# EAGLE design chassis (EAGLE 7.3.0)
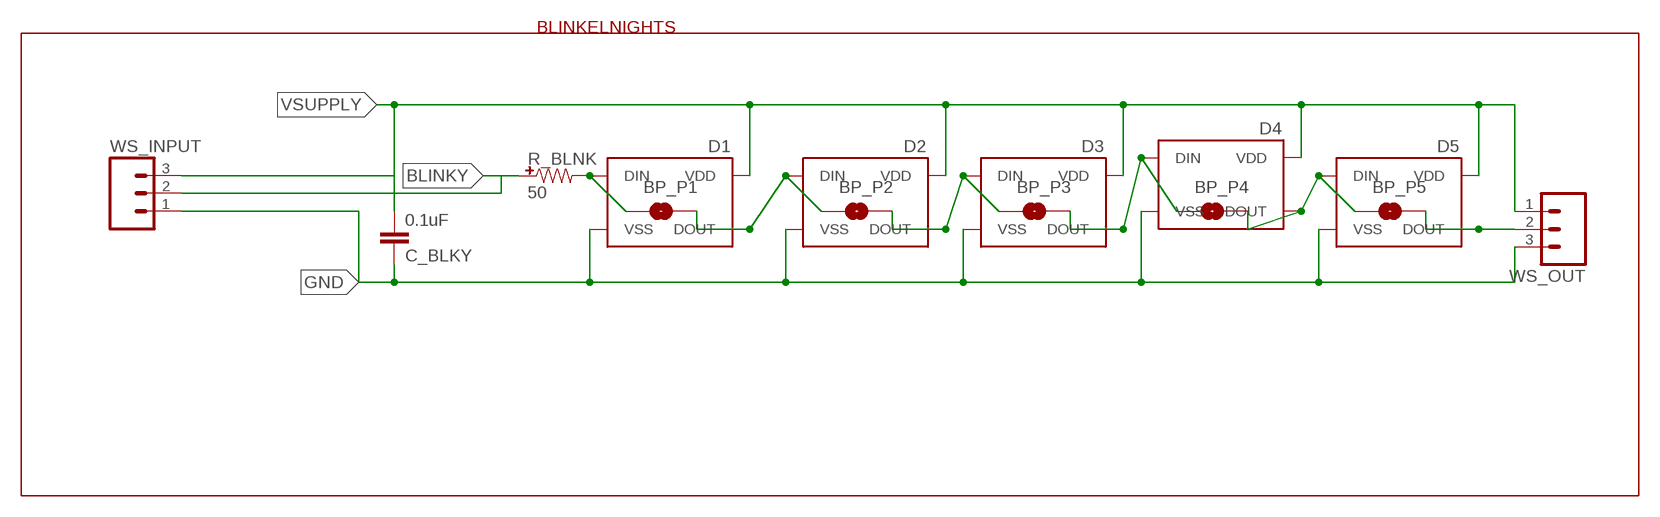
[diagram p0: schematic, sheet 1]

## Parts
BP_P1  JUMPER-PAD-2-NOYES_SILK  [PAD-JUMPER-2-NO_YES_SILK]
BP_P2  JUMPER-PAD-2-NOYES_SILK  [PAD-JUMPER-2-NO_YES_SILK]
BP_P3  JUMPER-PAD-2-NOYES_SILK  [PAD-JUMPER-2-NO_YES_SILK]
BP_P4  JUMPER-PAD-2-NOYES_SILK  [PAD-JUMPER-2-NO_YES_SILK]
BP_P5  JUMPER-PAD-2-NOYES_SILK  [PAD-JUMPER-2-NO_YES_SILK]
C_BLKY  0.1uF  CAPUNIVERSAL  [0402-0603-0805-UNIVERSAL]
D1  WS2812B  [WS2812B]
D2  WS2812B  [WS2812B]
D3  WS2812B  [WS2812B]
D4  WS2812B  [WS2812B]
D5  WS2812B  [WS2812B]
R_BLNK  50  RESISTORUNIVERSAL  [0402-0603-0805-UNIVERSAL]
WS_INPUT  M03LOCK  [1X03_LOCK]
WS_OUT  M03LOCK  [1X03_LOCK]

## Nets
BLINKY: R_BLNK.- WS_INPUT.2
GND: C_BLKY.- D1.3(VSS) D2.3(VSS) D3.3(VSS) D4.3(VSS) D5.3(VSS) WS_INPUT.1 WS_OUT.3
N$3: BP_P1.2 BP_P2.1 D1.2(DOUT) D2.4(DIN)
N$4: BP_P4.2 BP_P5.1 D4.2(DOUT) D5.4(DIN)
N$6: BP_P5.2 D5.2(DOUT) WS_OUT.2
N$10: BP_P1.1 D1.4(DIN) R_BLNK.+
N$11: BP_P2.2 BP_P3.1 D2.2(DOUT) D3.4(DIN)
N$12: BP_P3.2 BP_P4.1 D3.2(DOUT) D4.4(DIN)
VSUPPLY: C_BLKY.+ D1.1(VDD) D2.1(VDD) D3.1(VDD) D4.1(VDD) D5.1(VDD) WS_INPUT.3 WS_OUT.1

## Notes on the sheet
- BLINKELNIGHTS

## Library data of the parts
BP_P1-BP_P5 = SparkFun-Passives:JUMPER-PAD-2-NO
C_BLKY = tekdemo:CAP: Capacitor Standard 0603 ceramic capacitor, and 0.1" leaded capacitor.
D1-D5 = tekdemo:WS2812B: WS2812B - Intelligent control LED integrated light source Technical Specifications: Power Supply Voltage (VDD): 3.5 to 5.3 V Input Voltage (VI): -0.5 to VDD+0.5 V Operating Junction Temperature (Topt): -25°C to +80°C Storage Temperature Range (Tstg): -55°C to +150°C
R_BLNK = tekdemo:RESISTOR: Resistor Basic schematic elements and footprints for 0603, 1206, and PTH resistors.
WS_INPUT WS_OUT = SparkFun-Connectors:M03: Header 3 Standard 3-pin 0.1" header. Use with straight break away headers (SKU : PRT-00116), right angle break away headers (PRT-00553), swiss pins (PRT-00743), machine pins (PRT-00117), and female headers (PRT-00115). Molex polarized connector foot print use with SKU : PRT-08232 with associated crimp pins and housings.

## Board
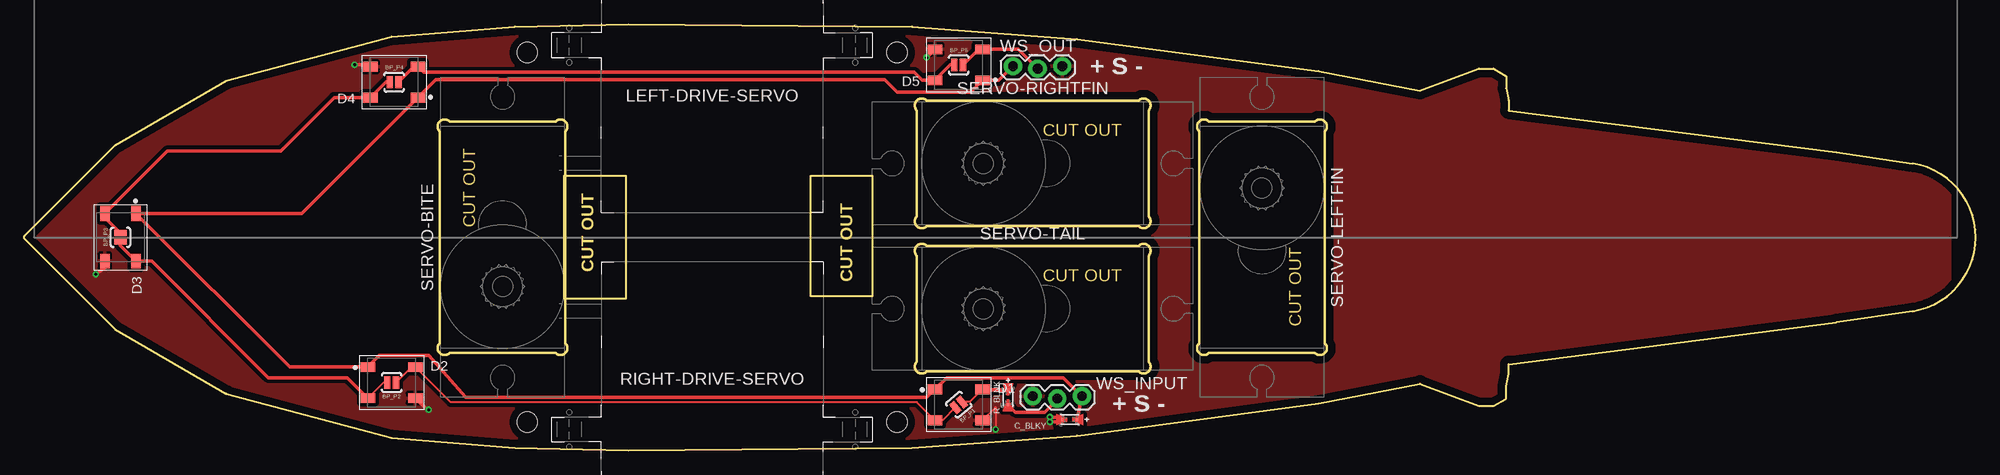
[diagram p1: board, top side]
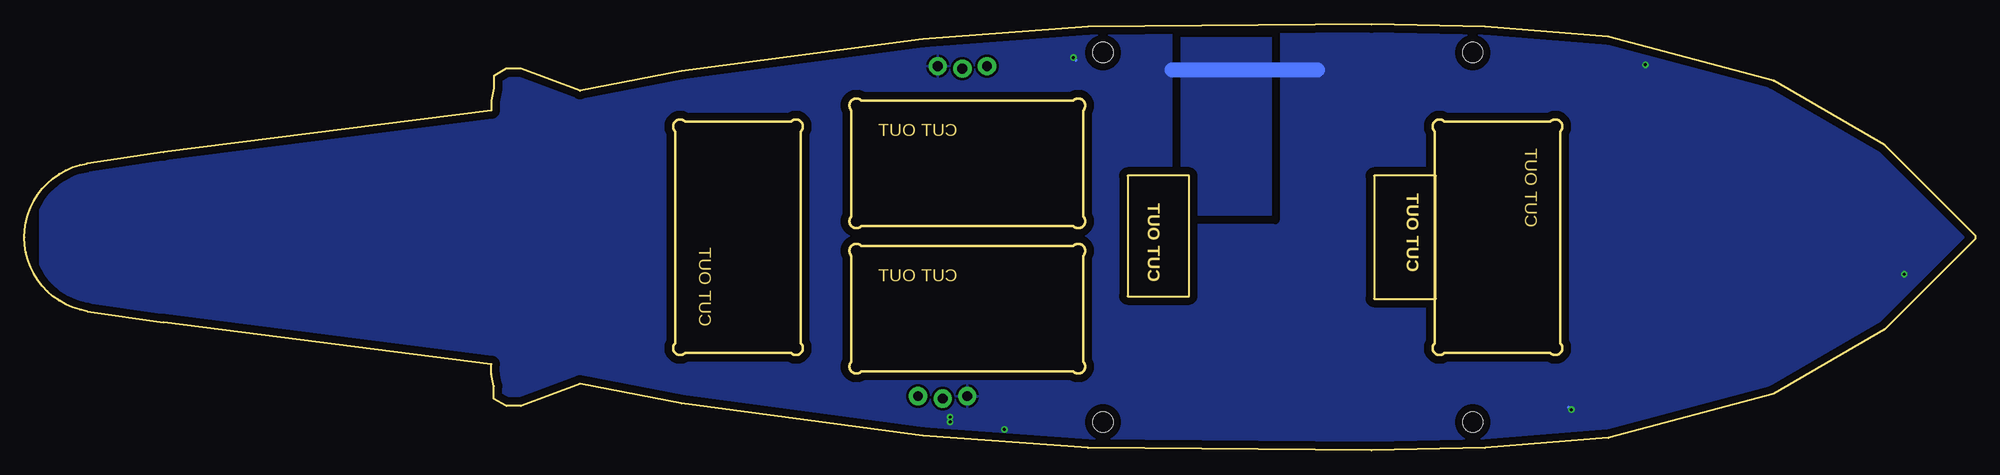
[diagram p2: board, bottom side, seen from below]

Size 201.04 x 43.94 mm. Coordinates in mm from the lower left corner, seen from the top.
Outline: 0,22.1 9.4,31.5 20.83,38.1 37.85,42.67 50.55,43.69 62.23,43.94 91.44,43.69 108.46,42.42 133.35,39.12 143.76,37.08 149.86,39.37 151.38,39.37 152.65,38.61 152.65,37.34 152.91,36.07 152.91,35.05 186.69,30.73 194.56,29.59 arc-161 194.56,14.35 186.69,13.21 152.91,8.89 152.91,7.87 152.65,6.6 152.65,5.33 151.38,4.57 149.86,4.57 143.76,6.86 133.35,4.83 108.46,1.52 91.44,0.25 62.23,0 50.55,0.25 37.85,1.27 20.83,5.84 9.4,12.45 0,21.84 0,22.1
Outline: 55.63,15.62 55.63,28.32 61.98,28.32 61.98,15.62 55.63,15.62
Outline: 81.03,15.88 81.03,28.32 87.38,28.32 87.38,15.88 81.03,15.88
Copper layers (1*16): Top 0.0356mm / dielectric 1.5011mm / Bottom 0.0356mm
Design rules "LaenPCBOrder-tented *": minimum track width 6mil, minimum drill 13mil, track to track 6mil, track to pad 6mil, pad to pad 6mil, via to via 6mil, smd to smd 0mil, copper to edge 30mil, drill to drill 6mil, minimum pad ring 7mil, minimum via ring 7mil, stop-mask expansion 4mil, vias tented up to drill 25mil, thermal gap 10mil
Holes 2.1 mm at 51.82,41.02 89.92,41.02 89.92,2.92 51.82,2.92
bRestrict: 4 lines
Milling: 178 lines

### Footprints (pad centres in the part's own frame; a part is rotated, then mirrored left to right if it is on the bottom)
PAD-JUMPER-2-NO_YES_SILK = smd 0.635 x 1.27: 1 -0.45,0; 2 0.45,0
0402-0603-0805-UNIVERSAL = smd 0.254 x 0.254: + -0.762,0; - 0.762,0
WS2812B = smd 1.5 x 1: 1 -2.45,1.6; 2 -2.45,-1.6; 3 2.45,-1.6; 4 2.45,1.6
1X03_LOCK = drill 1.016 pad 1.88: 1 0,0.127; 2 2.54,-0.127; 3 5.08,0.127

### Placement (x,y rotation side)
BP_P1  96.27,4.7 220 top
BP_P2  37.85,6.98 180 top
BP_P3  9.91,21.97 90 top
BP_P4  38.1,37.97 0 top
BP_P5  96.27,39.75 0 top
C_BLKY  107.7,3.17 180 top
D1  96.27,4.7 0 top
D2  37.85,6.98 0 top
D3  9.91,21.97 270 top
D4  38.1,37.97 180 top
D5  96.27,39.75 180 top
LEFT-DRIVE-SERVO  [MICROSERVO-HORIZONTAL]  59.44,24.51 0 top
R_BLNK  101.35,5.46 270 top
RIGHT-DRIVE-SERVO  RIGHT-DRIVE-SERVO  [MICROSERVO-HORIZONTAL-FLIPPED]  82.3,19.43 180 top
SERVO-BITE  [MICROSERVER-VERTICAL]  55.63,10.54 90 top
SERVO-LEFTFIN  [MICROSERVER-VERTICAL]  121.16,33.4 270 top
SERVO-RIGHTFIN  [MICROSERVER-VERTICAL]  92.46,23.24 0 top
SERVO-TAIL  [MICROSERVER-VERTICAL]  92.46,8.26 0 top
WS_INPUT  103.89,5.46 0 top
WS_OUT  101.85,39.5 0 top

### Tracks (layer width: path | path; a pad name or v marks a point on that pad's centre or on a via)
BLINKY
  Top 0.381: R_BLNK.- 102.11,3.94 105.16,3.94 106.43,5.21 WS_INPUT.2
GND  (via drill 0.3)
  Top 0.203: D1.3 100.06,4.44 v100.08,2.16
  Top 0.381: D3.3 8.13,18.68 v7.37,18.16 | D2.3 41.49,4.19 v41.66,4.19 | D4.3 35.47,39.75 v34.04,39.75 | D5.3 92.98,40.51 v92.96,40.51 | C_BLKY.- 106.68,2.92 v105.66,2.92 | v105.66,3.43 106.43,3.43 arc-90 106.68,3.17
  Bottom 0.381: v41.66,4.19 41.91,4.44 | v92.96,40.51 92.71,40.26
  Bottom 1.524: 82.8,39.24 67.82,39.24
  pour Bottom (isolate 0.254, rank 2): 199.39,-0.89 0,-0.89 0,44.07 199.39,44.07
  pour Top (isolate 0.381): 0,-2.67 0,45.34 198.37,45.34 198.37,-2.67
N$3
  Top 0.203: BP_P1.2 94.61,3.1 D1.2 91.96,4.95 43.93,4.95 D2.4 39.9,8.59 BP_P2.1
N$4
  Top 0.381: BP_P4.2 40.15,39.57 D4.2 41.13,38.99 91.69,38.99 92.53,38.15 D5.4 95.42,39.75 BP_P5.1
N$6
  Top 0.381: BP_P5.2 98.32,41.35 D5.2 102.41,41.35 WS_OUT.2
N$10
  Top 0.203: 98.72,6.31 D1.4 97.41,4.99 BP_P1.1
  Top 0.381: R_BLNK.+ 98.79,6.22 D1.4
N$11
  Top 0.203: BP_P2.2 37,6.98 D2.2
  Top 0.381: D2.2 33.29,7.49 25.15,7.49 13.12,19.52 D3.4 9.91,21.12 BP_P3.1
N$12
  Top 0.381: BP_P3.2 8.31,24.02 D3.2 14.75,30.86 26.42,30.86 31.93,36.37 D4.4 37.25,37.97 BP_P4.1
VSUPPLY
  Top 0.381: WS_OUT.1 100.38,38.15 D5.1 97.52,36.96 89.92,36.96 88.65,38.23 42.4,38.23 D4.1 28.6,24.42 D3.1 27.34,8.59 D2.1 36.59,9.78 41.66,9.78 45.47,5.46 92.98,5.46 D1.1 95.01,7.49 107.06,7.49 WS_INPUT.3 C_BLKY.+

### Text on the board
Top: LAN'd Shark V3 / 25-AUG-2015
Dimension: CUT OUT | CUT OUT
tPlace: + S - | + S -
tStop: LAN'd Shark V3 / 25-AUG-2015